# Altium schematic sheet master-schematic.SchDoc
size A4; SheetNumber: 1; SheetTotal: 1
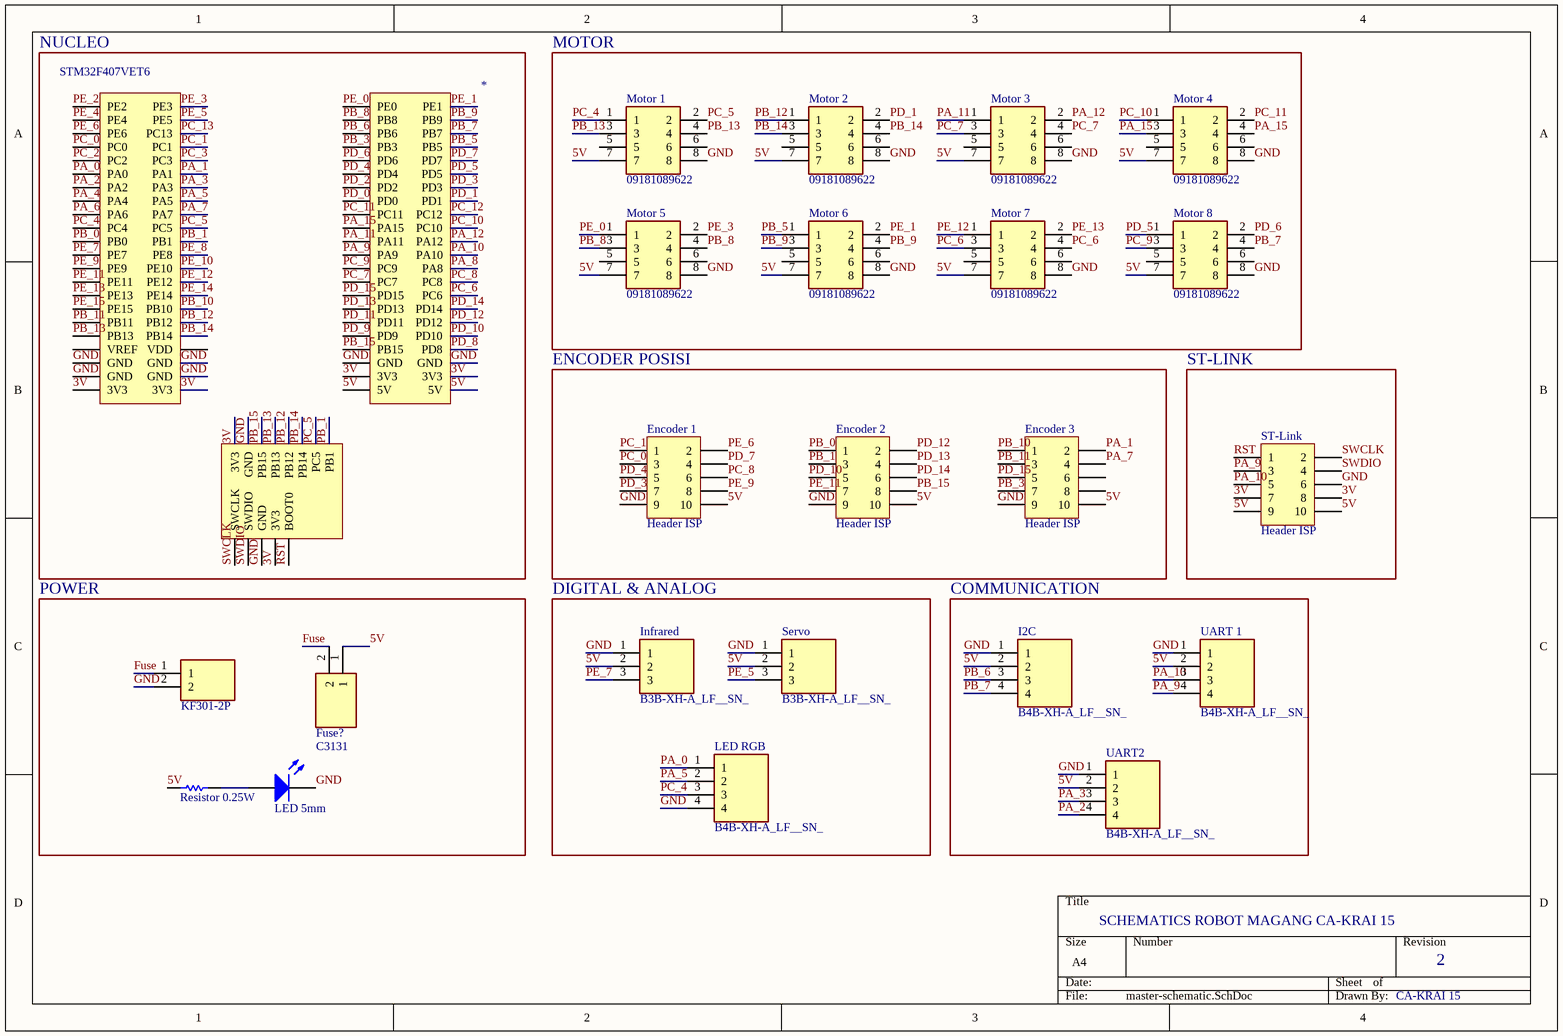
[diagram p0: master-schematic.SchDoc]

## Parts
*  STM32F407VET6  [MICON]
Encoder_1  Header ISP  [Header ISP]
Encoder_2  Header ISP  [Header ISP]
Encoder_3  Header ISP  [Header ISP]
Fuse?  C3131  [C3131]
I2C  B4B-XH-A_LF__SN_  [B4BXHALFSN]
Infrared  B3B-XH-A_LF__SN_  [B3BXHALFSN]
led?  LED 5mm  [LED 5mm]
LED_RGB  B4B-XH-A_LF__SN_  [B4BXHALFSN]
Motor_1  09181089622  [09181089622]
Motor_2  09181089622  [09181089622]
Motor_3  09181089622  [09181089622]
Motor_4  09181089622  [09181089622]
Motor_5  09181089622  [09181089622]
Motor_6  09181089622  [09181089622]
Motor_7  09181089622  [09181089622]
Motor_8  09181089622  [09181089622]
Power?  KF301-2P  [KF3012P]
R?  Resistor 0.25W  [Resistor 0.25W]
Servo  B3B-XH-A_LF__SN_  [B3BXHALFSN]
ST-Link  Header ISP  [Header ISP]
UART2  B4B-XH-A_LF__SN_  [B4BXHALFSN]
UART_1  B4B-XH-A_LF__SN_  [B4BXHALFSN]

## Blocks framed on the sheet
NUCLEO: *
MOTOR: Motor_1-Motor_8
ENCODER POSISI: Encoder_1-Encoder_3
ST-LINK: ST-Link
POWER: Fuse? led? Power? R?
DIGITAL & ANALOG: Infrared LED_RGB Servo
COMMUNICATION: I2C UART2 UART_1

## Nets
3V: *.3V3 ST-Link.7 ST-Link.8
5V: *.5V Encoder_1.10 Encoder_2.10 Encoder_3.10 Fuse?.1 I2C.2 Infrared.2 Motor_1.7 Motor_2.7 Motor_3.7 Motor_4.7 Motor_5.7 Motor_6.7 Motor_7.7 Motor_8.7 R?.1 Servo.2 ST-Link.9 ST-Link.10 UART2.2 UART_1.2
Fuse: Fuse?.2 Power?.1
GND: *.GND Encoder_1.9 Encoder_2.9 Encoder_3.9 I2C.1 Infrared.1 led?.2(K) LED_RGB.4 Motor_1.8 Motor_2.8 Motor_3.8 Motor_4.8 Motor_5.8 Motor_6.8 Motor_7.8 Motor_8.8 Power?.2 Servo.1 ST-Link.6 UART2.1 UART_1.1
PA_0: *.PA0 LED_RGB.1
PA_1: *.PA1 Encoder_3.2
PA_2: *.PA2 UART2.4
PA_3: *.PA3 UART2.3
PA_4: *.PA4
PA_5: *.PA5 LED_RGB.2
PA_6: *.PA6
PA_7: *.PA7 Encoder_3.4
PA_8: *.PA8
PA_9: *.PA9 ST-Link.3 UART_1.4
PA_10: *.PA10 ST-Link.5 UART_1.3
PA_11: *.PA11 Motor_3.1
PA_12: *.PA12 Motor_3.2
PA_15: *.PA15 Motor_4.3 Motor_4.4
PB_0: *.PB0 Encoder_2.1
PB_1: *.PB1 Encoder_2.3
PB_3: *.PB3 Encoder_3.7
PB_5: *.PB5 Motor_6.1
PB_6: *.PB6 I2C.3
PB_7: *.PB7 I2C.4 Motor_8.4
PB_8: *.PB8 Motor_5.3 Motor_5.4
PB_9: *.PB9 Motor_6.3 Motor_6.4
PB_10: *.PB10 Encoder_3.1
PB_11: *.PB11 Encoder_3.3
PB_12: *.PB12 Motor_2.1
PB_13: *.PB13 Motor_1.3 Motor_1.4
PB_14: *.PB14 Motor_2.3 Motor_2.4
PB_15: *.PB15 Encoder_2.8
PC_0: *.PC0 Encoder_1.3
PC_1: *.PC1 Encoder_1.1
PC_2: *.PC2
PC_3: *.PC3
PC_4: *.PC4 LED_RGB.3 Motor_1.1
PC_5: *.PC5 Motor_1.2
PC_6: *.PC6 Motor_7.3 Motor_7.4
PC_7: *.PC7 Motor_3.3 Motor_3.4
PC_8: *.PC8 Encoder_1.6
PC_9: *.PC9 Motor_8.3
PC_10: *.PC10 Motor_4.1
PC_11: *.PC11 Motor_4.2
PC_12: *.PC12
PC_13: *.PC13
PD_0: *.PD0
PD_1: *.PD1 Motor_2.2
PD_2: *.PD2
PD_3: *.PD3 Encoder_1.7
PD_4: *.PD4 Encoder_1.5
PD_5: *.PD5 Motor_8.1
PD_6: *.PD6 Motor_8.2
PD_7: *.PD7 Encoder_1.4
PD_8: *.PD8
PD_9: *.PD9
PD_10: *.PD10 Encoder_2.5
PD_11: *.PD11
PD_12: *.PD12 Encoder_2.2
PD_13: *.PD13 Encoder_2.4
PD_14: *.PD14 Encoder_2.6
PD_15: *.PD15 Encoder_3.5
PE_0: *.PE0 Motor_5.1
PE_1: *.PE1 Motor_6.2
PE_2: *.PE2
PE_3: *.PE3 Motor_5.2
PE_4: *.PE4
PE_5: *.PE5 Servo.3
PE_6: *.PE6 Encoder_1.2
PE_7: *.PE7 Infrared.3
PE_8: *.PE8
PE_9: *.PE9 Encoder_1.8
PE_10: *.PE10
PE_11: *.PE11 Encoder_2.7
PE_12: *.PE12 Motor_7.1
PE_13: *.PE13 Motor_7.2
PE_14: *.PE14
PE_15: *.PE15
RST: *.BOOT0 ST-Link.1
SWCLK: *.SWCLK ST-Link.2
SWDIO: *.SWDIO ST-Link.4
Netled?_1: led?.1(A) R?.2

Not connected (* = marked no-connect by the designer): * VDD VREF; Encoder_3 6 8; Motor_1 5 6; Motor_2 5 6; Motor_3 5 6; Motor_4 5 6; Motor_5 5 6; Motor_6 5 6; Motor_7 5 6; Motor_8 5 6

## Notes on the sheet
- SCHEMATICS ROBOT MAGANG CA-KRAI 15
- 2
- CA-KRAI 15

## Library data of the parts
* = Micon?
Encoder_1 Encoder_3 = Header ISP: Encoder Posisi X
Encoder_2 = Header ISP: Encoder Posisi Y
Fuse? = C3131: Undefined or Miscellaneous; Manufacturer_Name: Xucheng Elec; Datasheet Link: https://datasheet.lcsc.com/szlcsc/XC-Elec-Shenzhen-5x20-BLX-Fuse-holder_C3131.pdf; Height: 10.5mm; Manufacturer_Part_Number: C3131
I2C LED_RGB UART2 UART_1 = B4B-XH-A_LF__SN_: Connector; Manufacturer_Name: JST (JAPAN SOLDERLESS TERMINALS); Manufacturer_Part_Number: B4B-XH-A(LF)(SN); Datasheet Link: https://datasheet.lcsc.com/szlcsc/JST-Sales-America-B4B-XH-A-LF-SN_C144395.pdf; Height: 7mm; Arrow Part Number: B4B-XH-A(LF)(SN); Arrow Price/Stock: https://www.arrow.com/en/products/b4b-xh-a-lf-sn/jst-manufacturing
Infrared = B3B-XH-A_LF__SN_: Connector; Manufacturer_Name: JST (JAPAN SOLDERLESS TERMINALS); Manufacturer_Part_Number: B3B-XH-A(LF)(SN); Datasheet Link: https://datasheet.lcsc.com/szlcsc/1812131720_JST-Sales-America-B3B-XH-A-LF-SN_C144394.pdf; Height: 7mm; Arrow Part Number: B3B-XH-A(LF)(SN); Arrow Price/Stock: https://www.arrow.com/en/products/b3b-xh-a-lf-sn/jst-manufacturing?region=europe
Motor_1-Motor_8 = 09181089622: Connector; Manufacturer_Name: HARTING; Datasheet Link: http://uk.rs-online.com/web/p/products/6935182; Height: 5.5mm; Manufacturer_Part_Number: 09181089622; Mouser Part Number: 617-09181089622; Mouser Price/Stock: https://www.mouser.co.uk/ProductDetail/HARTING/09181089622?qs=FeiuqfHlVTv2CjJEejdN9Q%3D%3D
Power? = KF301-2P: Connector; Manufacturer_Name: Handson Technology; Datasheet Link: http://www.handsontec.com/dataspecs/terminal%20block-5mm.pdf; Height: 10mm; Manufacturer_Part_Number: KF301-2P
Servo = B3B-XH-A_LF__SN_: Servo pin; Manufacturer_Name: JST (JAPAN SOLDERLESS TERMINALS); Manufacturer_Part_Number: B3B-XH-A(LF)(SN); Datasheet Link: https://datasheet.lcsc.com/szlcsc/1812131720_JST-Sales-America-B3B-XH-A-LF-SN_C144394.pdf; Height: 7mm; Arrow Part Number: B3B-XH-A(LF)(SN); Arrow Price/Stock: https://www.arrow.com/en/products/b3b-xh-a-lf-sn/jst-manufacturing?region=europe
ST-Link = Header ISP: ST-Link Port